# Altium schematic sheet 小车.SchDoc
size 381 x 241 mm
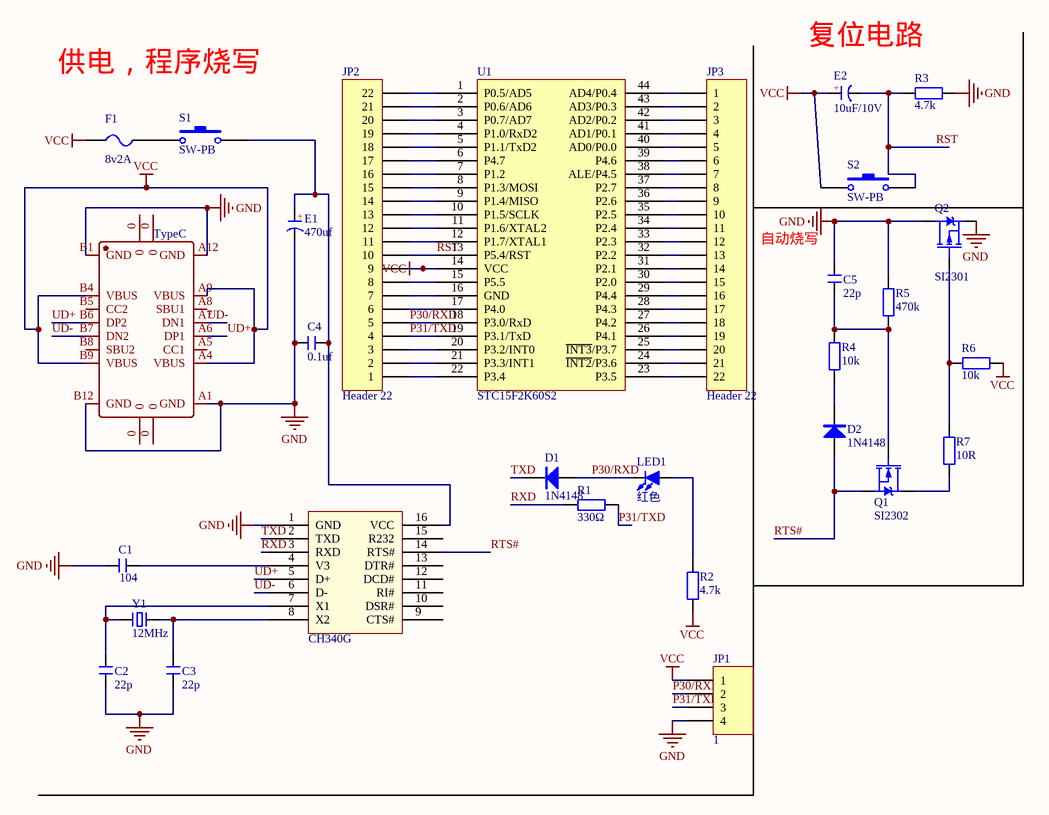
[diagram p0: 小车.SchDoc]

## Parts
C1  104  [C 0805]
C2  22p  [C 0805]
C3  22p  [C 0805]
C4  0.1uf  [C 0805]
C5  22p  [C 0805]
CH340G  CH340G  [sop16_L]  (value not drawn)
D1  1N4148  [MINI_MELF (LL34)]
D2  1N4148  [MINI_MELF (LL34)]
E1  470uf  [CM A(3*5.4)]
E2  10uF/10V  [CM A(3*5.4)]
F1  8v2A  [FU 0402]
JP1  1  [HDR1X4]
JP2  Header 22  [HDR1X22]
JP3  Header 22  [HDR1X22]
LED1  红色  [LED 0805G]
Q1  SI2302  [SOT23-3N]
Q2  SI2301  [SOT23-3N]
R1  330Ω  [R 0805]
R2  4.7k  [R 0805]
R3  4.7k  [R 0805]
R4  10k  [R 0805]
R5  470k  [R 0805]
R6  10k  [R 0805]
R7  10R  [R 0805]
S1  SW-PB  [SW_PB2_A1]
S2  SW-PB  [SW_PB2_A1]
TypeC  TypeC-16pin  [typeC-16pin]  (value not drawn)
U1  STC15F2K60S2  [LQFP44 10X10_L]
Y1  12MHz  [OSC HC-49SMD]

## Nets
GND: C1.1 C2.2 C3.2 C4.1 C5.1 CH340G.1(GND) E1.2(K) JP1.4 Q2.2(S) Q2.3(D) R3.1 R5.1 TypeC.A1(GND) TypeC.A12(GND) TypeC.B1(GND) TypeC.B12(GND)
VCC: E2.1(A) F1.1 JP1.1 JP2.9 R2.2 R6.1 S2.1 TypeC.A4(VBUS) TypeC.A9(VBUS) TypeC.B4(VBUS) TypeC.B9(VBUS) U1.14(VCC)
P30/RXD: D1.1(A) JP1.2 JP2.5 LED1.2(K) U1.18(P3.0/RxD)
P31/TXD: JP1.3 JP2.4 R1.2 U1.19(P3.1/TxD)
RST: E2.2(K) JP2.10 R3.2 S2.2 U1.13(P5.4/RST)
RTS#: CH340G.14(RTS#) D2.1(A) Q1.2(S)
RXD: CH340G.3(RXD) R1.1
TXD: CH340G.2(TXD) D1.2(K)
UD+: CH340G.5(D+) TypeC.A6(DP1) TypeC.B6(DP2)
UD-: CH340G.6(D-) TypeC.A7(DN1) TypeC.B7(DN2)
NetC1_2: C1.2 CH340G.4(V3)
NetC2_1: C2.1 CH340G.7(X1) Y1.1
NetC3_1: C3.1 CH340G.8(X2) Y1.2
NetC4_2: C4.2 CH340G.16(VCC) E1.1(A) S1.2
NetC5_2: C5.2 Q1.1(G) R4.1 R5.2
NetD2_2: D2.2(K) R4.2
NetF1_2: F1.2 S1.1
NetJP2_1: JP2.1 U1.22(P3.4)
NetJP2_2: JP2.2 U1.21(P3.3/INT1)
NetJP2_3: JP2.3 U1.20(P3.2/INT0)
NetJP2_6: JP2.6 U1.17(P4.0)
NetJP2_7: JP2.7 U1.16(GND)
NetJP2_8: JP2.8 U1.15(P5.5)
NetJP2_11: JP2.11 U1.12(P1.7/XTAL1)
NetJP2_12: JP2.12 U1.11(P1.6/XTAL2)
NetJP2_13: JP2.13 U1.10(P1.5/SCLK)
NetJP2_14: JP2.14 U1.9(P1.4/MISO)
NetJP2_15: JP2.15 U1.8(P1.3/MOSI)
NetJP2_16: JP2.16 U1.7(P1.2)
NetJP2_17: JP2.17 U1.6(P4.7)
NetJP2_18: JP2.18 U1.5(P1.1/TxD2)
NetJP2_19: JP2.19 U1.4(P1.0/RxD2)
NetJP2_20: JP2.20 U1.3(P0.7/AD7)
NetJP2_21: JP2.21 U1.2(P0.6/AD6)
NetJP2_22: JP2.22 U1.1(P0.5/AD5)
NetJP3_1: JP3.1 U1.44(AD4/P0.4)
NetJP3_2: JP3.2 U1.43(AD3/P0.3)
NetJP3_3: JP3.3 U1.42(AD2/P0.2)
NetJP3_4: JP3.4 U1.41(AD1/P0.1)
NetJP3_5: JP3.5 U1.40(AD0/P0.0)
NetJP3_6: JP3.6 U1.39(P4.6)
NetJP3_7: JP3.7 U1.38(ALE/P4.5)
NetJP3_8: JP3.8 U1.37(P2.7)
NetJP3_9: JP3.9 U1.36(P2.6)
NetJP3_10: JP3.10 U1.35(P2.5)
NetJP3_11: JP3.11 U1.34(P2.4)
NetJP3_12: JP3.12 U1.33(P2.3)
NetJP3_13: JP3.13 U1.32(P2.2)
NetJP3_14: JP3.14 U1.31(P2.1)
NetJP3_15: JP3.15 U1.30(P2.0)
NetJP3_16: JP3.16 U1.29(P4.4)
NetJP3_17: JP3.17 U1.28(P4.3)
NetJP3_18: JP3.18 U1.27(P4.2)
NetJP3_19: JP3.19 U1.26(P4.1)
NetJP3_20: JP3.20 U1.25(~{INT3}/P3.7)
NetJP3_21: JP3.21 U1.24(~{INT2}/P3.6)
NetJP3_22: JP3.22 U1.23(P3.5)
NetLED1_1: LED1.1(A) R2.1
NetQ1_3: Q1.3(D) R7.2
NetQ2_1: Q2.1(G) R6.2 R7.1

Not connected (* = marked no-connect by the designer): CH340G 9(CTS#) 10(DSR#) 11(RI#) 12(DCD#) 13(DTR#) 15(R232); TypeC 0 A5(CC1) A8(SBU1) B5(CC2) B8(SBU2)

## Notes on the sheet
- 供电，程序烧写
- 复位电路
- 自动烧写
- (in symbol C-CM) +

## Library data of the parts
C1-C5 = C: 无极性贴片电容; 版权归属: 黎明电子style; BOM名称: 无极性贴片电容; 学习资源: https://lmdzstyle.taobao.com/
D1 D2 = 1N4148: 高速开关二极管; 版权归属: 源创客; BOM名称: 高速开关二极管; 学习资源: www.ooocke.com
E1 E2 = C-CM: 贴片电解电容; 版权归属: 黎明电子style; BOM名称: 贴片电解电容; 学习资源: https://lmdzstyle.taobao.com/
F1 = FU: 贴片保险丝; 版权归属: 源创客; BOM名称: 贴片保险丝; 学习资源: www.ooocke.com
JP1 = Header 4: Header, 4-Pin; LatestRevisionDate: 17-Jul-2002; LatestRevisionNote: Re-released for DXP Platform.; Publisher: Altium Limited
JP2 JP3 = Header 22: Header, 22-Pin; LatestRevisionDate: 17-Jul-2002; LatestRevisionNote: Re-released for DXP Platform.; Publisher: Altium Limited
LED1 = LED-SMD: 贴片LED; 版权归属: 黎明电子style; BOM名称: 贴片LED; 学习资源: https://lmdzstyle.taobao.com/
Q1 = SI2302: N沟道场效应管; 版权归属: 黎明电子style; BOM名称: N沟道场效应管; 学习资源: https://lmdzstyle.taobao.com/
Q2 = SI2301: P沟道场效应管; 版权归属: 黎明电子style; BOM名称: P沟道场效应管; 学习资源: https://lmdzstyle.taobao.com/
R1-R7 = R: 贴片电阻; 版权归属: 黎明电子style; BOM名称: 贴片电阻; 学习资源: https://lmdzstyle.taobao.com/
S1 S2 = SW-PB: 微动开关; Published: 24-Mar-1999; LatestRevisionDate: 17-Jul-2002; LatestRevisionNote: Re-released for DXP Platform.; PackageReference: SPST-2; Publisher: Altium Limited
TypeC = TypeC-16pin: USB-C-16Pin
U1 = STC15F2K60S2-44pin: STC单片机; 版权归属: 校基地硬件部; BOM名称: STC单片机
Y1 = XTAL-2P: 2脚无源脚晶振; 版权归属: 源创客; BOM名称: 2脚无源脚晶振; 学习资源: www.ooocke.com